# EAGLE design mic_bobV1 (EAGLE 9.5.2)
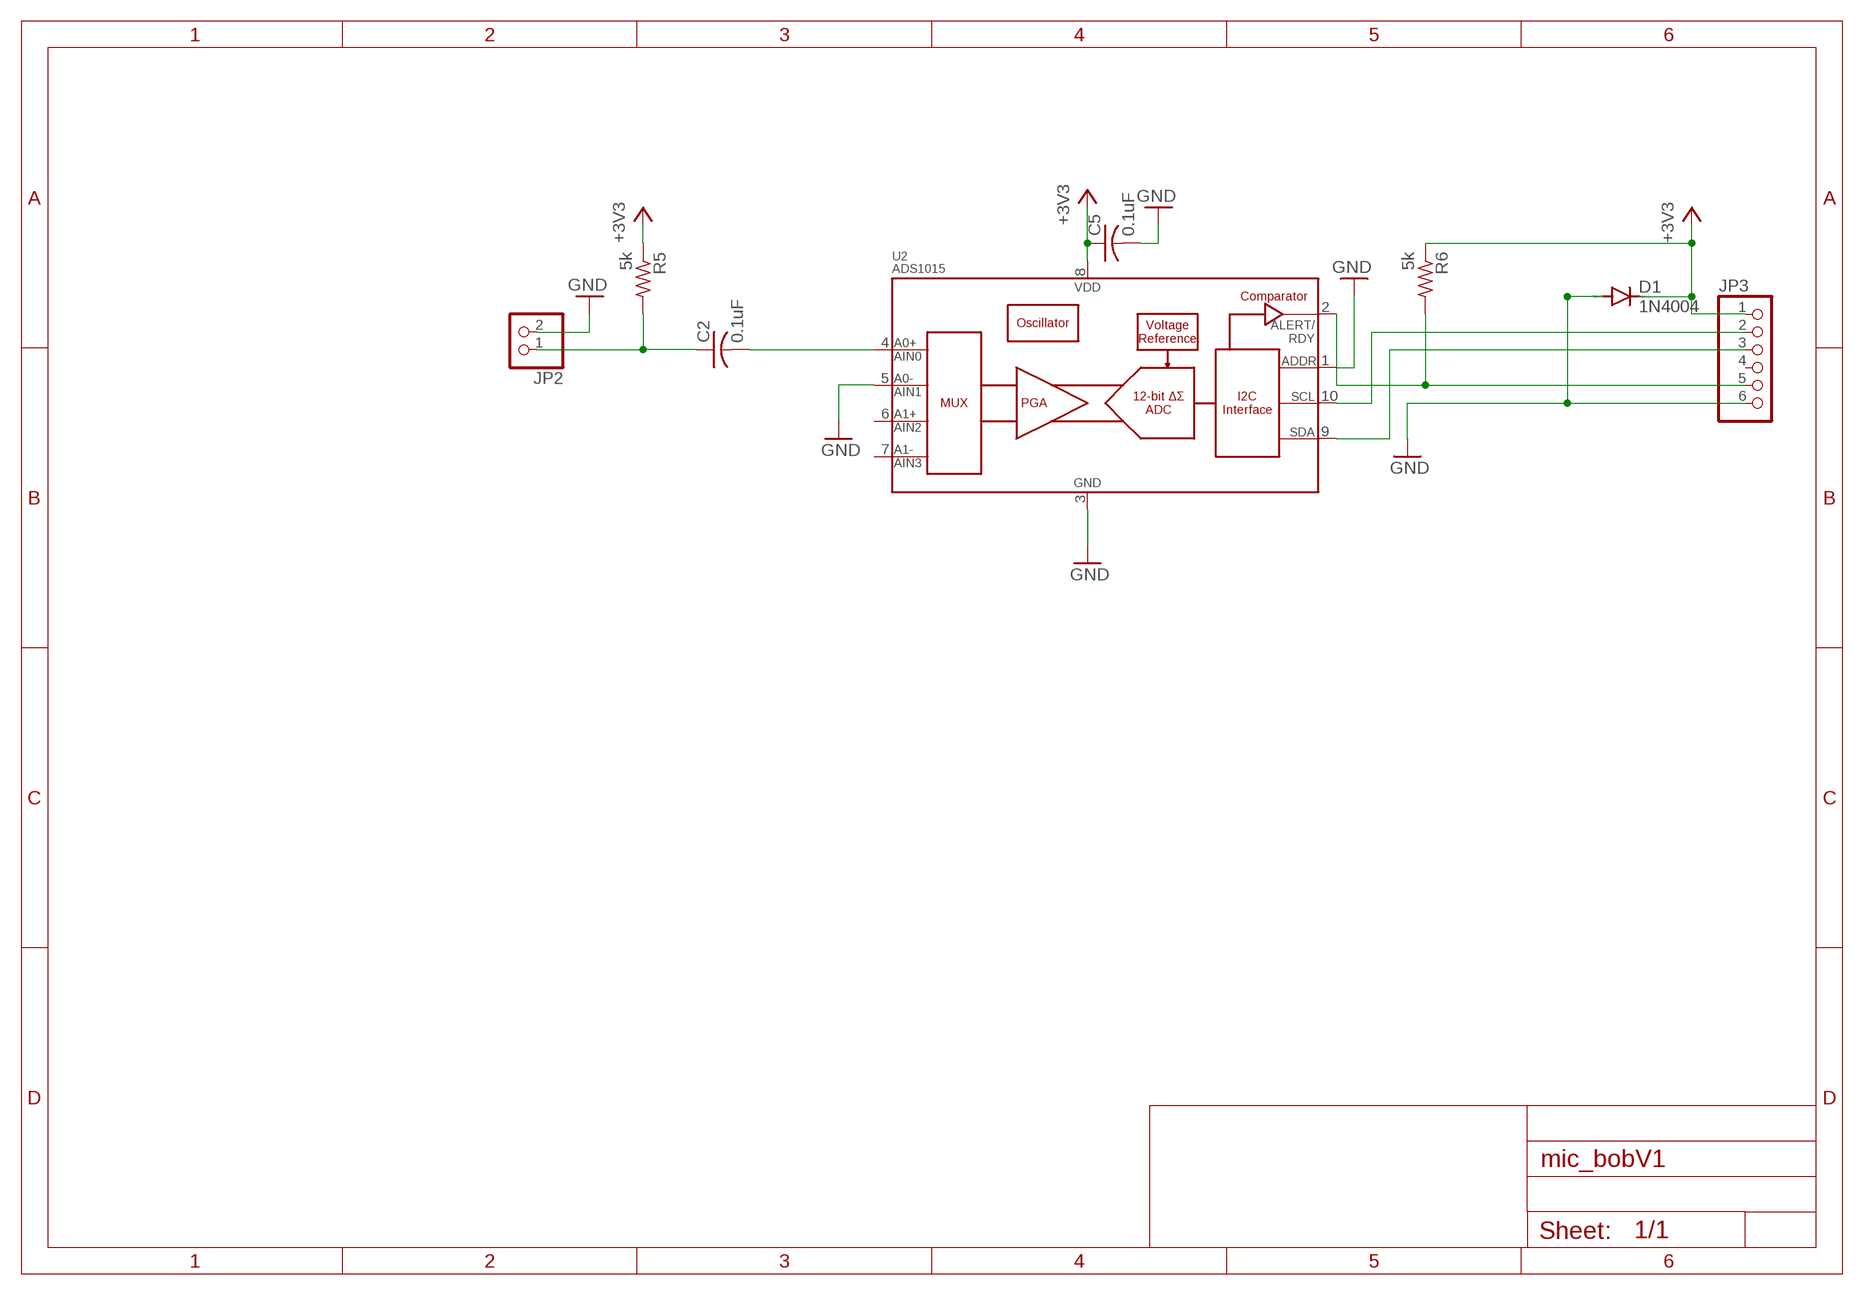
[diagram p0: schematic, sheet 1]

## Parts
C2  0.1uF  C-USC1206  [C1206]
C5  0.1uF  C-USC1206  [C1206]
D1  1N4004  [DO41-10]
JP2  PINHD-1X2  [1X02]
JP3  PINHD-1X6  [1X06]
R5  5k  R-US_0207/10  [0207/10]
R6  5k  R-US_0207/10  [0207/10]
U2  ADS1015  [MSOP10]

## Nets
+3V3: C5.1 D1.C JP3.1 R5.1 R6.1 U2.8(VDD)
GND: C5.2 D1.A JP2.2 JP3.6 U2.1(ADDR) U2.3(VSS) U2.5(AIN1)
N$4: C2.1 JP2.1 R5.2
N$5: C2.2 U2.4(AIN0)
N$8: JP3.5 R6.2 U2.2(ALERT/RDY)
N$9: JP3.2 U2.10(SCL)
N$11: JP3.3 U2.9(SDA)
Unconnected: JP3.4 U2.6(AIN2) U2.7(AIN3)

## Library data of the parts
C2 C5 = rcl:C-US: CAPACITOR, American symbol; SPICEPREFIX: C
D1 = diode:1N4004: DIODE general purpose rectifier, 1 A
JP2 = pinhead:PINHD-1X2: PIN HEADER
JP3 = pinhead:PINHD-1X6: PIN HEADER
R5 R6 = rcl:R-US_: RESISTOR, American symbol; SPICEPREFIX: R
U2 = SparkFun-IC-Conversion:ADS1015: ADS1015 12-BIT ADC 12-Bit Del-Sig ADC Four single-ended inputs or two differential inputs Internal PGA I2C interface 2.0-5.5V SparkFun Products SparkFun Block for Intel Edison - ADC <https://www.sparkfun.com/products/13770> (DEV-13770); PROD_ID: IC-12270

## Board
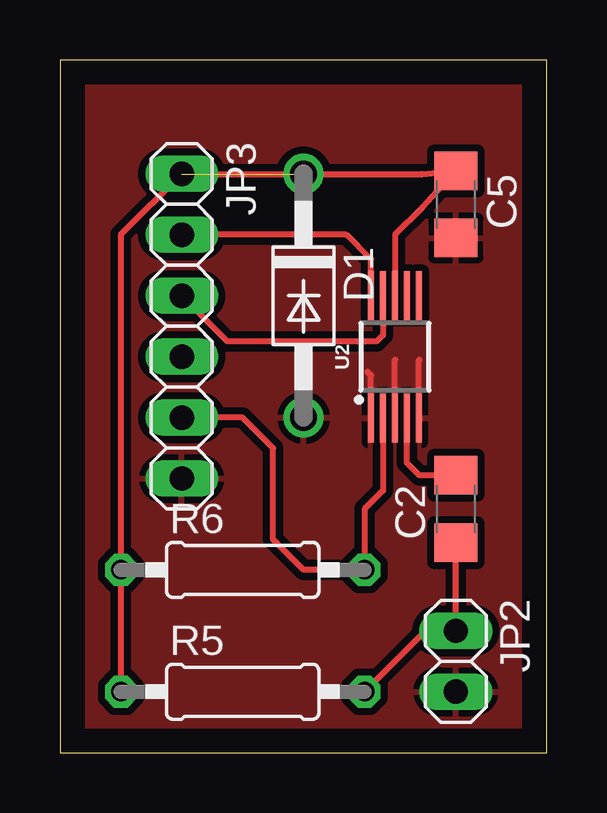
[diagram p1: board, top side]

Size 20.3 x 28.88 mm. Coordinates in mm from the lower left corner, seen from the top.
Outline: 0,0 20.3,0 20.3,28.88 0,28.88 0,0
Copper layers (1*16): Top 0.035mm / dielectric 1.5mm / Bottom 0.035mm
Design rules "default *": minimum track width 6mil, minimum drill 0.35mm, track to track 12mil, track to pad 12mil, pad to pad 12mil, via to via 6mil, smd to smd 6mil, copper to edge 40mil, drill to drill 6mil, minimum pad ring 10mil, minimum via ring 8mil, stop-mask expansion 4mil, vias tented up to drill 0mil, thermal gap 10mil

### Footprints (pad centres in the part's own frame; a part is rotated, then mirrored left to right if it is on the bottom)
C1206 = smd 1.6 x 1.8: 1 -1.4,0; 2 1.4,0
DO41-10 = drill 1.118: A 5.08,0; C -5.08,0
1X02 = drill 1.016 long: 1 -1.27,0; 2 1.27,0
1X06 = drill 1.016 long: 1 -6.35,0; 2 -3.81,0; 3 -1.27,0; 4 1.27,0; 5 3.81,0; 6 6.35,0
0207/10 = drill 0.813 octagon: 1 -5.08,0; 2 5.08,0
MSOP10 = smd 0.25 x 2: 1 -1,-2.55; 2 -0.5,-2.55; 3 0,-2.55; 4 0.5,-2.55; 5 1,-2.55; 6 1,2.55; 7 0.5,2.55; 8 0,2.55; 9 -0.5,2.55; 10 -1,2.55

### Placement (x,y rotation side)
C2  16.51,10.16 90 top
C5  16.51,22.86 270 top
D1  10.16,19.05 270 top
JP2  16.51,3.81 270 top
JP3  5.08,17.78 270 top
R5  7.62,2.54 0 top
R6  7.62,7.62 0 top
U2  13.97,16.51 0 top

### Tracks (layer width: path | path; a pad name or v marks a point on that pad's centre or on a via)
+3V3  (1 unrouted)
  Top 0.254: U2.8 13.97,21.59 15.11,22.73 C5.1 15.11,24.13 6.35,24.13 JP3.1 2.54,21.59 R6.1 R5.1
GND
  Top 0.254: U2.1 12.97,15.73 12.83,15.88 | U2.3 13.97,16.38 | U2.5 14.97,16.37 14.99,16.38
  pour Top: -1.27,33.02 25.4,33.02 25.4,-1.27 -1.27,-1.27
N$4
  Top 0.254: R5.2 15.24,5.08 JP2.1 C2.1
N$5
  Top 0.254: C2.2 14.98,11.56 14.47,12.07 U2.4
N$8
  Top 0.254: JP3.5 7.62,13.97 8.89,12.7 8.89,8.89 10.16,7.62 R6.2 12.7,10.16 13.47,10.93 U2.2
N$9
  Top 0.254: U2.10 12.97,20.56 11.94,21.59 JP3.2
N$11
  Top 0.254: U2.9 13.47,17.41 13.21,17.14 6.99,17.14 JP3.3